# EAGLE design Bedroom_Adapter (EAGLE 6.5.0)
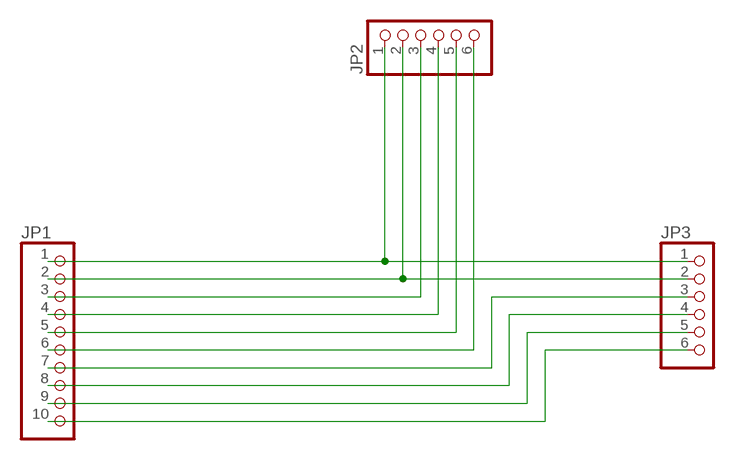
[diagram p0: schematic, sheet 1]

## Parts
JP1  PINHD-1X10  [1X10]
JP2  PINHD-1X6  [1X06]
JP3  PINHD-1X6  [1X06]

## Nets
N$1: JP1.1 JP2.1 JP3.1
N$2: JP1.2 JP2.2 JP3.2
N$3: JP1.3 JP2.3
N$4: JP1.4 JP2.4
N$5: JP1.5 JP2.5
N$6: JP1.6 JP2.6
N$7: JP1.7 JP3.3
N$8: JP1.8 JP3.4
N$10: JP1.9 JP3.5
N$11: JP1.10 JP3.6

## Library data of the parts
JP1 = pinhead:PINHD-1X10: PIN HEADER
JP2 JP3 = pinhead:PINHD-1X6: PIN HEADER

## Board
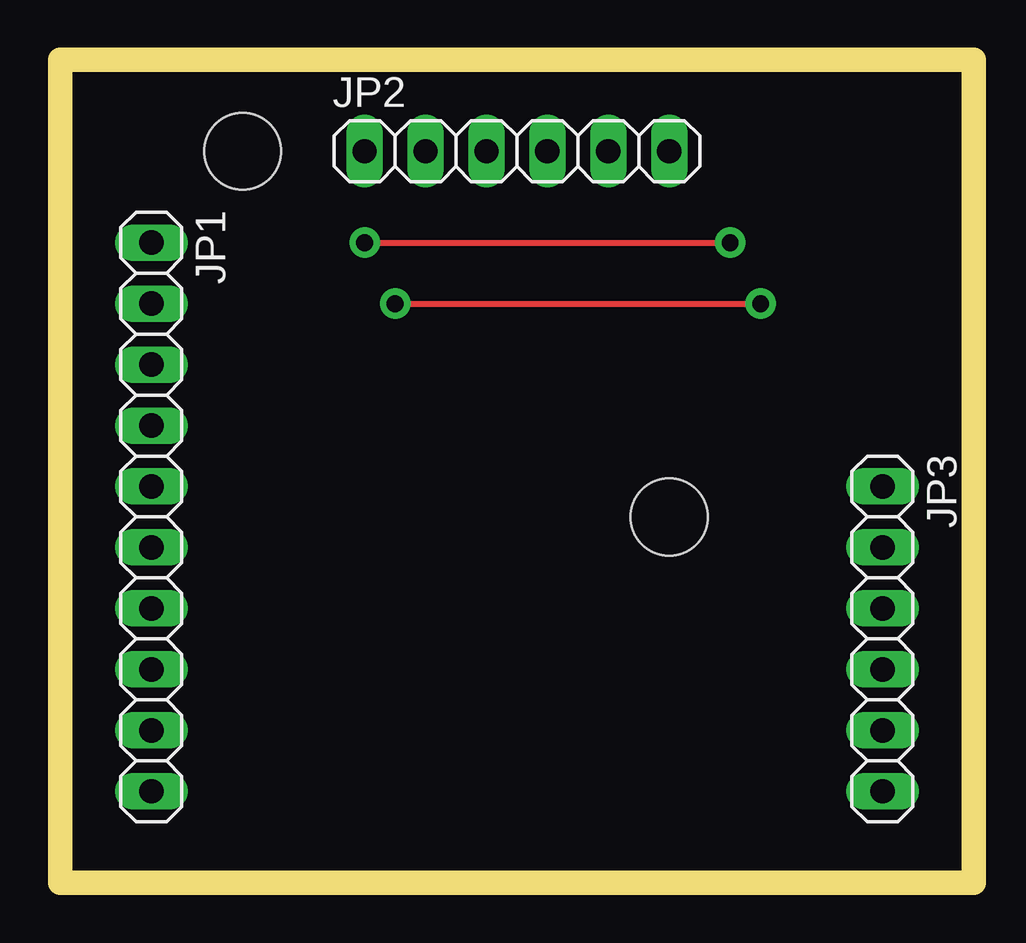
[diagram p1: board, top side]
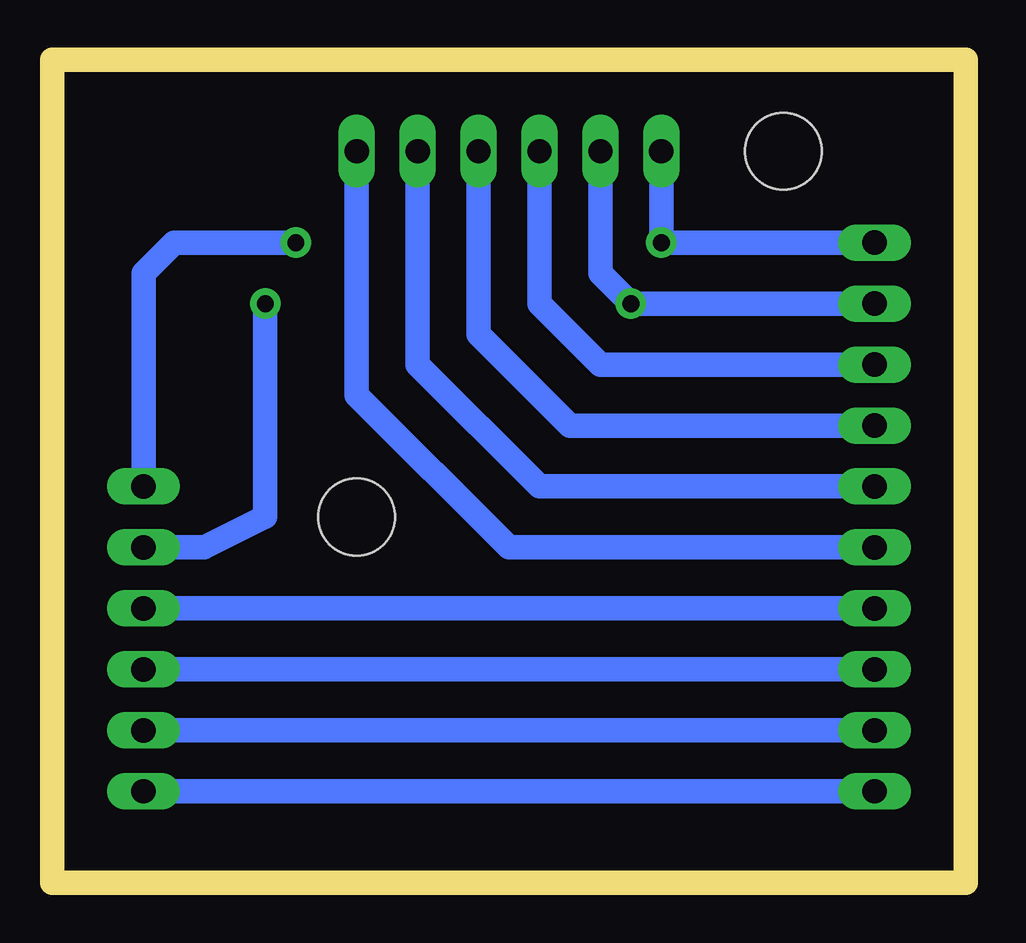
[diagram p2: board, bottom side, seen from below]

Size 37.77 x 34.28 mm. Coordinates in mm from the lower left corner, seen from the top.
Outline: 0,0 37.77,0 37.77,34.28 0,34.28 0,0
Copper layers (1*16): Top 0.035mm / dielectric 1.5mm / Bottom 0.035mm
Design rules "default": minimum track width 10mil, minimum drill 24mil, track to track 8mil, track to pad 8mil, pad to pad 8mil, via to via 8mil, smd to smd 8mil, copper to edge 40mil, drill to drill 8mil, minimum pad ring 10mil, minimum via ring 8mil, stop-mask expansion 4mil, vias tented up to drill 0mil, thermal gap 10mil
Holes 3.2 mm at 7.62,30.48 25.4,15.24
Milling: 4 lines

### Footprints (pad centres in the part's own frame; a part is rotated, then mirrored left to right if it is on the bottom)
1X10 = drill 1.016 long: 1 -11.43,0; 2 -8.89,0; 3 -6.35,0; 4 -3.81,0; 5 -1.27,0; 6 1.27,0; 7 3.81,0; 8 6.35,0; 9 8.89,0; 10 11.43,0
1X06 = drill 1.016 long: 1 -6.35,0; 2 -3.81,0; 3 -1.27,0; 4 1.27,0; 5 3.81,0; 6 6.35,0

### Placement (x,y rotation side)
JP1  3.81,15.24 270 top
JP2  19.05,30.48 0 top
JP3  34.29,10.16 270 top

### Tracks (layer width: path | path; a pad name or v marks a point on that pad's centre or on a via)
N$1  (via drill 0.7 pad 1.27)
  Top 0.254: v12.7,26.67 v27.94,26.67
  Bottom 1.016: JP1.1 v12.7,26.67 JP2.1 | JP3.1 34.29,25.4 33.02,26.67 v27.94,26.67
N$2  (via drill 0.7 pad 1.27)
  Top 0.254: v13.97,24.13 v29.21,24.13
  Bottom 1.016: JP1.2 v13.97,24.13 15.24,25.4 JP2.2 | v29.21,24.13 29.21,15.24 31.75,13.97 JP3.2
N$3
  Bottom 1.016: JP1.3 15.24,21.59 17.78,24.13 JP2.3
N$4
  Bottom 1.016: JP1.4 16.51,19.05 20.32,22.86 JP2.4
N$5
  Bottom 1.016: JP1.5 17.78,16.51 22.86,21.59 JP2.5
N$6
  Bottom 1.016: JP1.6 19.05,13.97 25.4,20.32 JP2.6
N$7
  Bottom 1.016: JP1.7 JP3.3
N$8
  Bottom 1.016: JP1.8 JP3.4
N$10
  Bottom 1.016: JP1.9 JP3.5
N$11
  Bottom 1.016: JP1.10 JP3.6